# EAGLE design LM317 Variable Regulator (EAGLE 9.6.2)
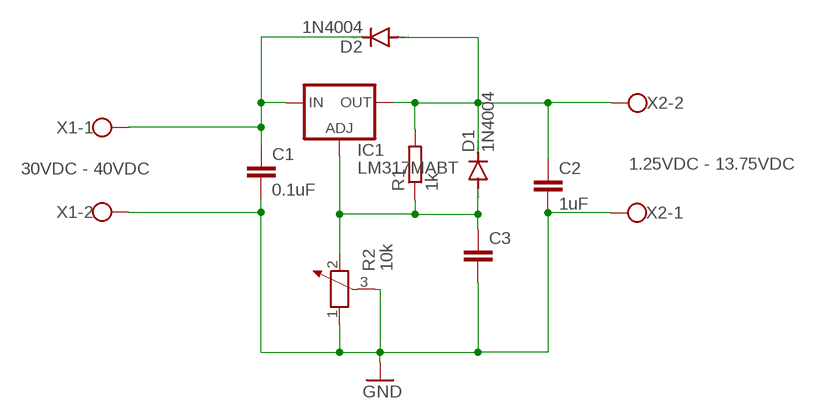
[diagram p0: schematic, sheet 1]

## Parts
C1  0.1uF  C-EU025-024X044  [C025-024X044]
C2  1uF  C-EU025-024X044  [C025-024X044]
C3  C-EU025-024X044  [C025-024X044]
D1  1N4004  [DO41-10]
D2  1N4004  [DO41-10]
IC1  LM317MABT  [TO220L1]
R1  1k  R-EU_0204/7  [0204/7]
R2  10k  POTENTIOMETER_PT-10  [PT-10]
X1  30VDC - 40VDC  W237-102  [W237-102]
X2  1.25VDC - 13.75VDC  W237-102  [W237-102]

## Nets
GND: C1.2 C2.2 C3.2 R2.1 R2.3 X1.2 X2.1
N$1: C1.1 D2.C IC1.3(IN) X1.1
N$2: C2.1 D1.C D2.A IC1.2(OUT) R1.2 X2.2
N$6: C3.1 D1.A IC1.1(ADJ) R1.1 R2.2

## Library data of the parts
C1-C3 = rcl:C-EU: CAPACITOR, European symbol; SPICEPREFIX: C
D1 D2 = diode:1N4004: DIODE general purpose rectifier, 1 A
IC1 = v-reg:LM317?*: 500 mA Adjustable Output Positive Voltage Regulator Source: http://www.onsemi.co.jp .. LM317M-D.PDF
R1 = rcl:R-EU_: RESISTOR, European symbol; SPICEPREFIX: R
R2 = rcl:POTENTIOMETER_: Potentiometer; SPICEMODEL: POT; SPICEPREFIX: X
X1 X2 = con-wago-500:W237-102: WAGO SCREW CLAMP; MPN: 237-102; OC_FARNELL: unknown; OC_NEWARK: 70K9898

## Board
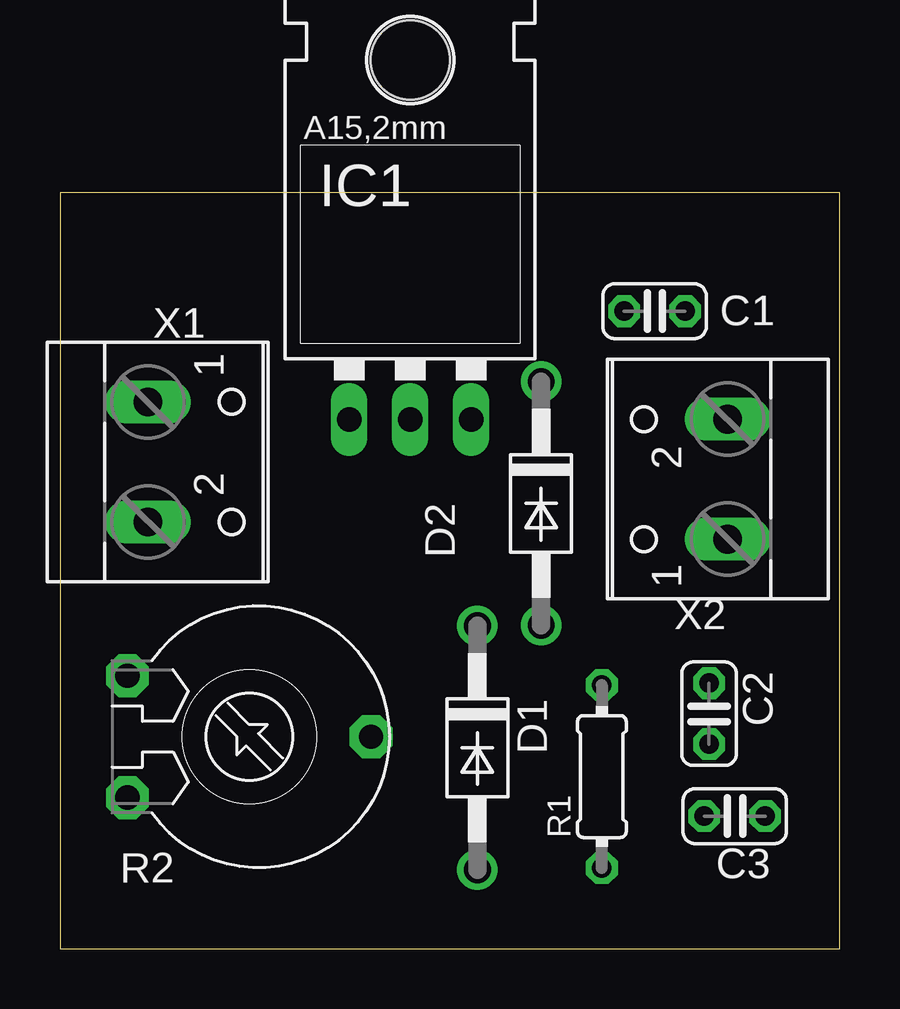
[diagram p1: board, top side]
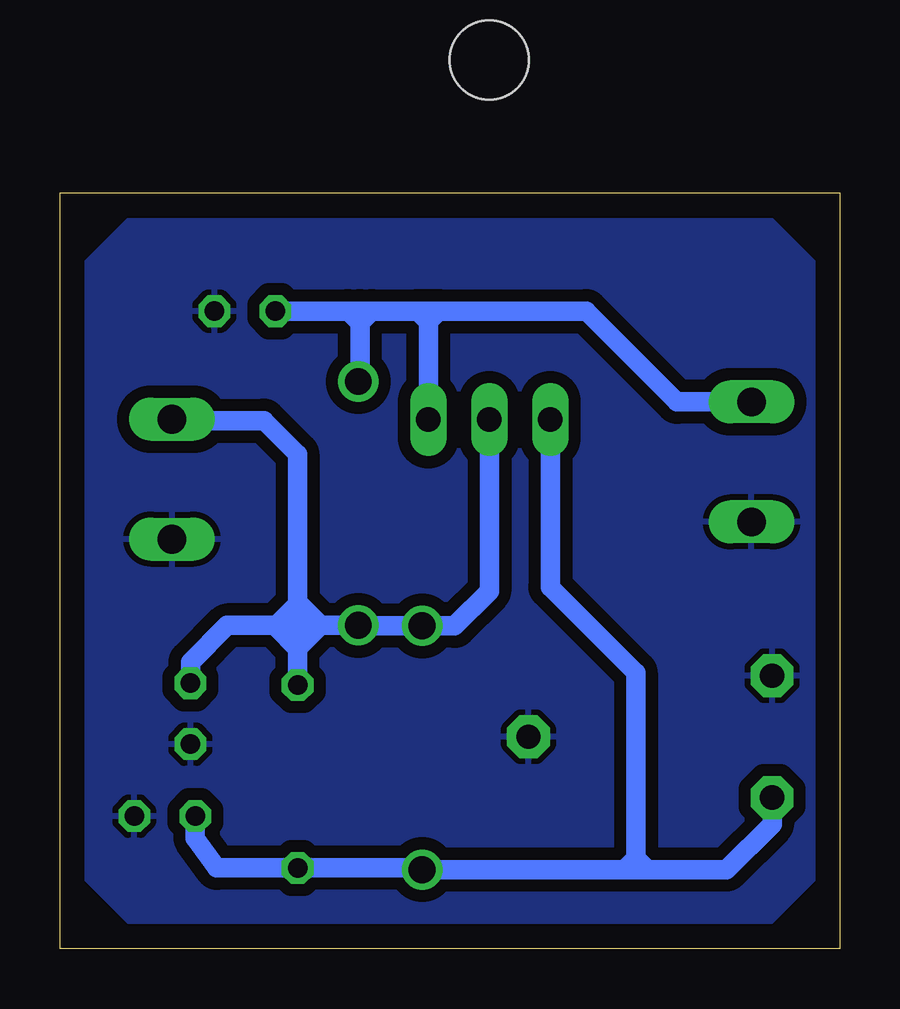
[diagram p2: board, bottom side, seen from below]

Size 32.5 x 31.5 mm. Coordinates in mm from the lower left corner, seen from the top.
Outline: 0,0 32.5,0 32.5,31.5 0,31.5 0,0
Copper layers (1*16): Top 0.035mm / dielectric 1.5mm / Bottom 0.035mm
Design rules "default *": minimum track width 6mil, minimum drill 0.35mm, track to track 20mil, track to pad 20mil, pad to pad 20mil, via to via 20mil, smd to smd 6mil, copper to edge 40mil, drill to drill 6mil, minimum pad ring 10mil, minimum via ring 8mil, stop-mask expansion 4mil, vias tented up to drill 0mil, thermal gap 10mil

### Footprints (pad centres in the part's own frame; a part is rotated, then mirrored left to right if it is on the bottom)
C025-024X044 = drill 0.813 octagon: 1 -1.27,0; 2 1.27,0
DO41-10 = drill 1.118: A 5.08,0; C -5.08,0
TO220L1 = drill 1.016 long: 1 -2.54,-3.81; 2 0,-3.81; 3 2.54,-3.81 | hole 3.302: 0,11.176
0204/7 = drill 0.813 octagon: 1 -3.81,0; 2 3.81,0
PT-10 = drill 1.016 pad 1.778 octagon: 1 -2.54,-5.08; 2 2.54,-5.08; 3 0,5.08
W237-102 = drill 1.194 long: 1 -2.5,-1.27; 2 2.5,-1.27

### Placement (x,y rotation side)
C1  24.79,26.56 0 top
C2  27.06,9.79 270 top
C3  28.13,5.52 0 top
D1  17.4,8.37 270 top
D2  20.06,18.55 270 top
IC1  14.6,25.85 0 top
R1  22.59,7.17 90 top
R2  7.89,8.83 270 top
X1  4.94,20.28 270 top
X2  26.56,19.56 90 top

### Tracks (layer width: path | path; a pad name or v marks a point on that pad's centre or on a via)
GND
  pour Bottom: 1,28.5 3,30.5 29.5,30.5 31.5,28.5 31.5,3 29.5,1 3,1 1,3
N$1
  Bottom 0.813: C1.1 20.5,26.56 | 20.5,26.56 20,26.56 | 20,26.56 19.5,26.56 | 19.5,26.56 17.6,26.56 | 17.6,26.56 17.2,26.56 | 17.2,26.56 17.1,26.56 | 17.1,26.56 16.7,26.56 | 16.7,26.56 10.56,26.56 6.78,22.78 X1.1 | D2.C 20,23.69 20,26.06 | 20,26.06 20,26.56 | 17.1,26.56 17.1,26.16 | 20,26.06 19.5,26.56 | 20,26.06 20.5,26.56 | IC1.3 17.14,26.5 17.2,26.56 | 17.1,26.16 16.7,26.56 | 17.1,26.16 17.2,26.16 17.6,26.56
N$2
  Bottom 0.813: C2.1 27.06,11.94 25.53,13.47 23.5,13.47 | X2.2 27.77,22 24,22 22.6,20.6 22.6,14.5 22.6,14.45 | IC1.2 14.6,14.9 16.05,13.45 D1.C 20.04,13.45 D2.A 21.62,13.47 | 21.62,13.47 22.5,13.47 | 22.5,13.47 22.6,13.47 | 22.6,13.47 23.5,13.47 | R1.2 22.59,12.5 | 22.59,12.5 22.59,13.38 22.5,13.47 | 22.6,14.45 22.6,13.47 | 21.62,13.47 22.59,12.5 | 22.59,12.5 23.5,13.41 23.5,13.47 | 22.6,14.45 21.62,13.47 | 22.6,14.45 22.6,14.37 23.5,13.47
N$6
  Bottom 0.813: 8,3.29 8.4,3.29 | 8.5,3.29 9,3.29 | 9,3.29 D1.A 17.47,3.36 R1.1 25.97,3.36 26.86,4.6 C3.1 | 8.5,3.79 8.5,11.5 12.06,15.06 IC1.1 | 8.5,3.79 8,3.29 | 8.5,3.79 9,3.29 | R2.2 2.81,5.19 4.71,3.29 8,3.29